# EAGLE design HoloProjector LED I2C v1.0 (EAGLE 6.4)
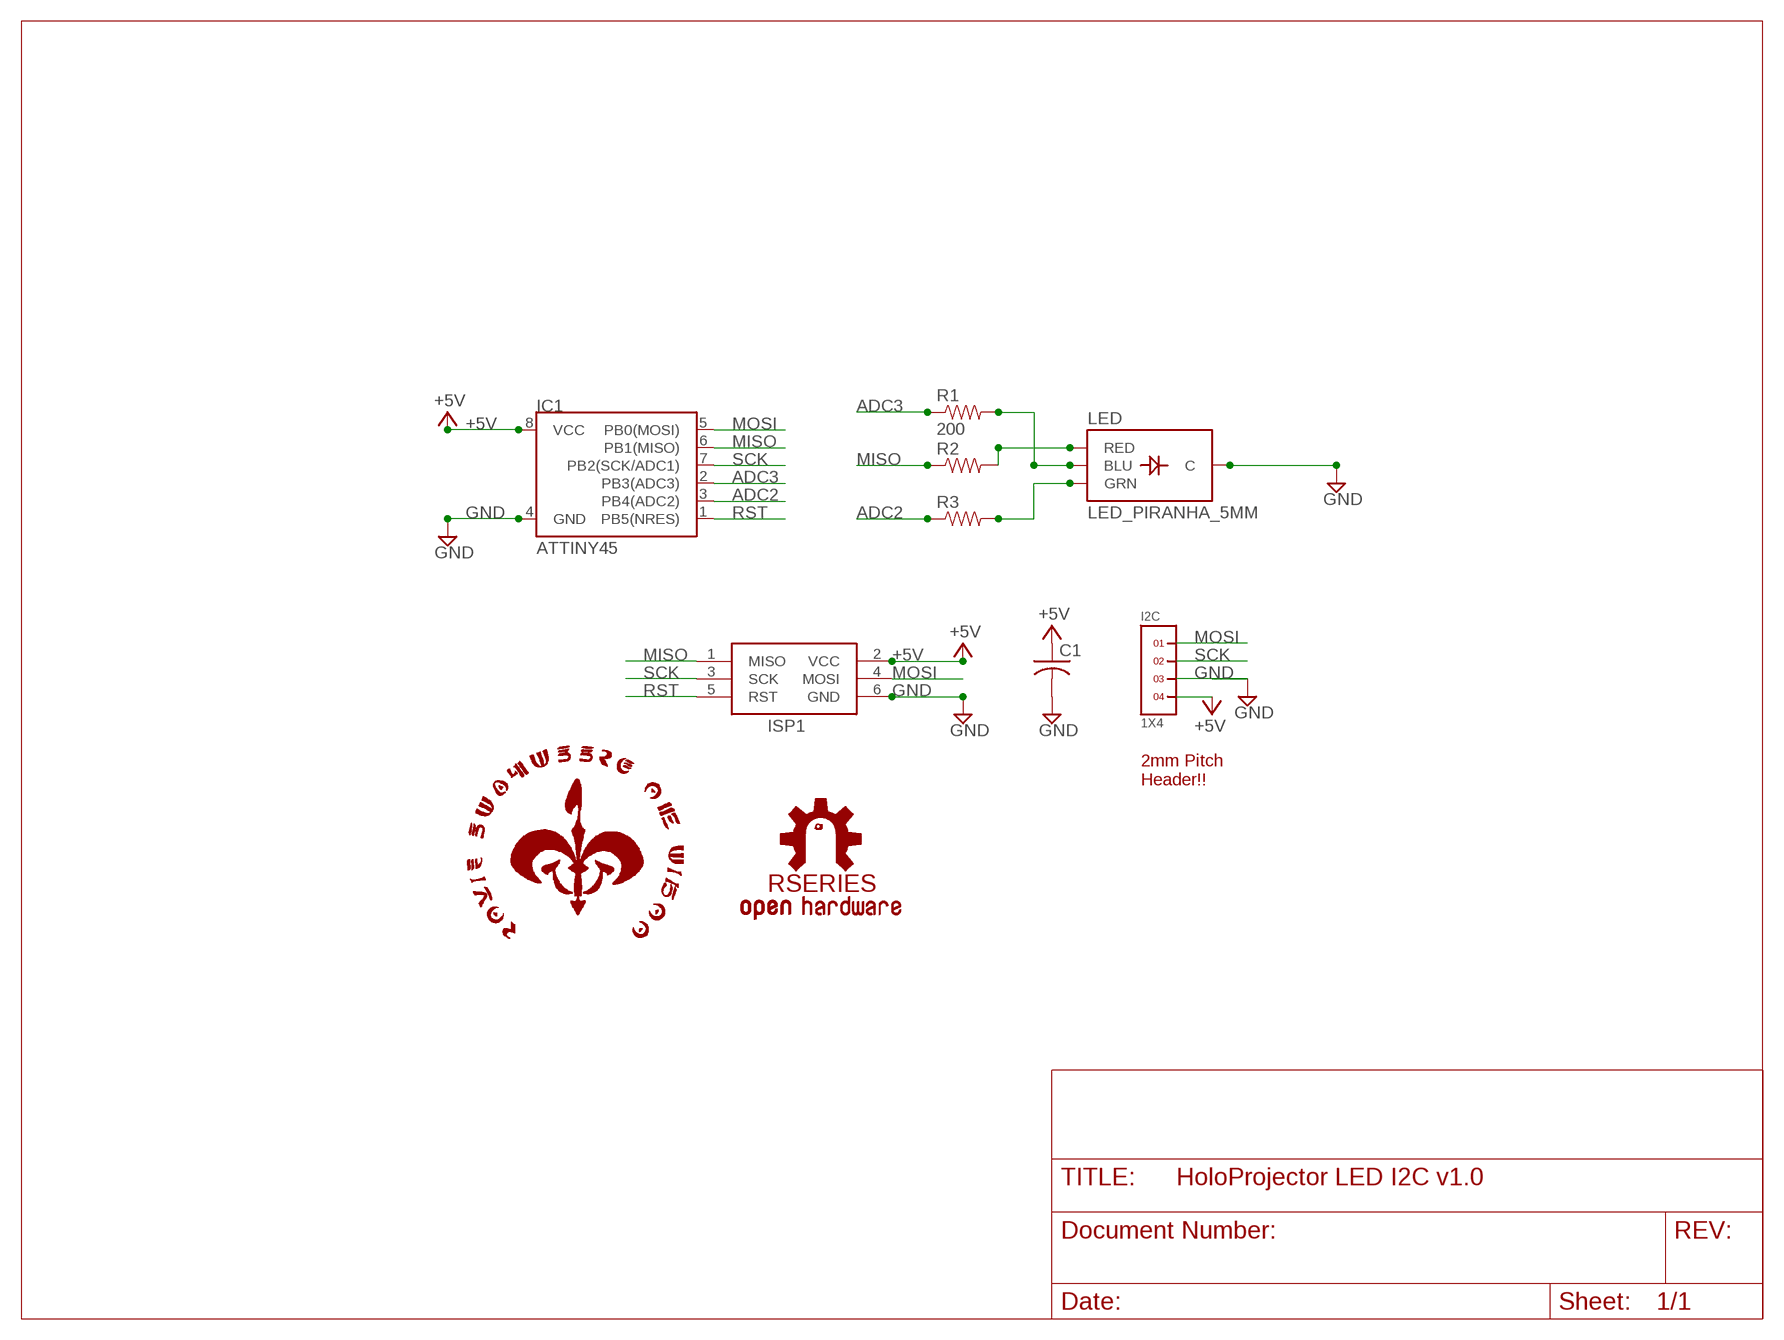
[diagram p0: schematic, sheet 1]

## Parts
C1  C-USC1206K  [C1206K]
I2C  1X4  [1X4]
IC1  ATTINY45  [SO08-EIAJ]
ISP1  AVRISP-6  [AVRISP]
LED  LED_PIRANHA_5MM  [LED_PIRANHA_5MM]
R1  200  RESISTOR1206  [1206]
R2  RESISTOR1206  [1206]
R3  RESISTOR1206  [1206]
U$1  ROYAL-ENGINEERS-OF-NABOOSMALL  [ROYAL-ENGINEERS-OF-NABOO-SMALL]
U$2  RSERIES-OSHW-LOGOMEDIUM  [RSERIES-OSHW-LOGO-MEDIUM]

## Nets
+5V [supply]: C1.1 I2C.4 IC1.8(VCC) ISP1.2(VCC)
ADC2: IC1.3(PB4(ADC2)) R3.1
ADC3: IC1.2(PB3(ADC3)) R1.1
GND [supply]: C1.2 I2C.3 IC1.4(GND) ISP1.6(GND) LED.-(C)
MISO: IC1.6(PB1(MISO)) ISP1.1(MISO) R2.1
MOSI: I2C.1 IC1.5(PB0(MOSI)) ISP1.4(MOSI)
N$1: LED.B(BLU) R1.2
N$2: LED.R(RED) R2.2
N$3: LED.G(GRN) R3.2
RST: IC1.1(PB5(NRES)) ISP1.5(RST)
SCK: I2C.2 IC1.7(PB2(SCK/ADC1)) ISP1.3(SCK)

## Notes on the sheet
- 2mm Pitch
  Header!!

## Library data of the parts
C1 = rcl:C-US: CAPACITOR, American symbol
I2C = headers(2mm):1X4
IC1 = SparkFun-DigitalIC:ATTINY45: Atmel 8-pin 2/4/8kB flash uC
ISP1 = adafruit:AVRISP: AVR ISP HEADER Standard 6 pin header for AVR programming
LED = SparkFun-LED:LED_PIRANHA_5MM: High-brightness RGB through-hole LED, similar to that used in the Shiftbrite
R1-R3 = SparkFun-Passives:RESISTOR: Resistor Basic schematic elements and footprints for 0603, 1206, and PTH resistors.
U$1 = rseries:ROYAL-ENGINEERS-OF-NABOO: Royal Engineers of Naboo Circle Logo
U$2 = rseries:RSERIES-OSHW-LOGO

## Net classes
1 supply: width 0.381 mm, clearance 0.152 mm

## Board
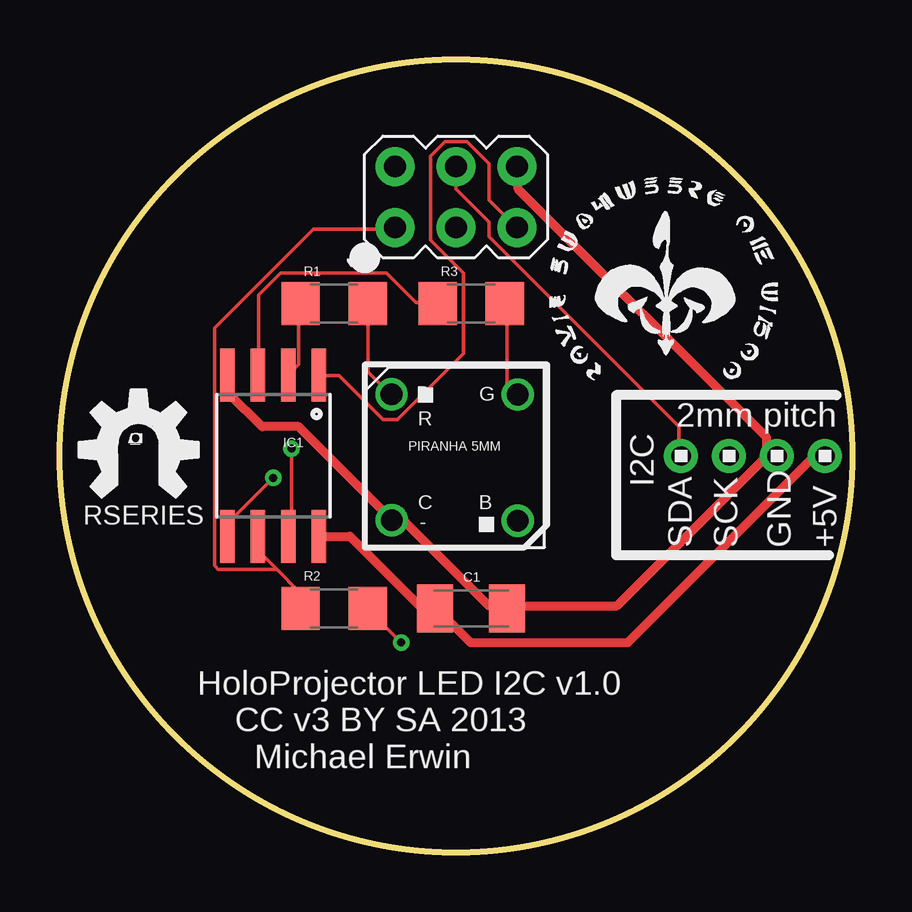
[diagram p1: board, top side]
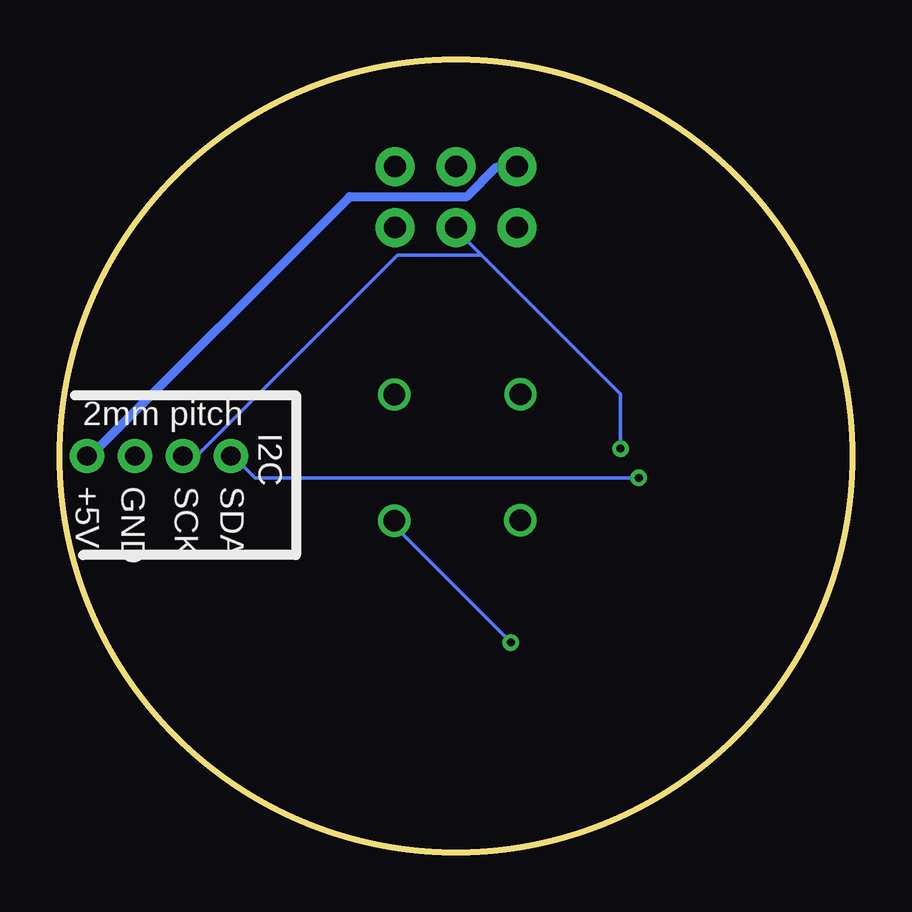
[diagram p2: board, bottom side, seen from below]

Size 33.02 x 33.02 mm. Coordinates in mm from the lower left corner, seen from the top.
Outline: circle at 16.51,16.51 radius 16.51
Copper layers (1*16): Top 0.0356mm / dielectric 1.5011mm / Bottom 0.0356mm
Design rules "LaenPCBOrder *": minimum track width 6mil, minimum drill 13mil, track to track 6mil, track to pad 6mil, pad to pad 6mil, via to via 12mil, smd to smd 6mil, copper to edge 15mil, drill to drill 6mil, minimum pad ring 7mil, minimum via ring 7mil, stop-mask expansion 4mil, vias tented up to drill 13mil, thermal gap 10mil

### Footprints (pad centres in the part's own frame; a part is rotated, then mirrored left to right if it is on the bottom)
C1206K = smd 1.5 x 2: 1 -1.5,0; 2 1.5,0
1X4 = drill 0.8 pad 1.422: 1 -3,0; 2 -1,0; 3 1,0; 4 3,0
SO08-EIAJ = smd 0.61 x 2.21: 1 -1.905,-3.378; 2 -0.635,-3.378; 3 0.635,-3.378; 4 1.905,-3.378; 5 1.905,3.353; 6 0.635,3.353; 7 -0.635,3.353; 8 -1.905,3.353
AVRISP = drill 0.9 pad 1.626: 1 -1.27,2.54; 2 1.27,2.54; 3 -1.27,0; 4 1.27,0; 5 -1.27,-2.54; 6 1.27,-2.54
LED_PIRANHA_5MM = drill 0.9: - -2.684,-2.684; B -2.688,2.574; G 2.575,2.562; R 2.579,-2.696
1206 = smd 1.6 x 1.8: 1 -1.4,0; 2 1.4,0

### Placement (x,y rotation side)
C1  17.14,10.16 0 top
I2C  28.89,16.51 0 top
IC1  8.89,16.51 180 top
ISP1  16.51,27.3 90 top
LED  16.51,16.51 0 top
R1  11.43,22.86 0 top
R2  11.43,10.16 0 top
R3  17.14,22.86 0 top
U$1  20.32,19.37 0 top
U$2  3.18,16.83 0 top

### Tracks (layer width: path | path; a pad name or v marks a point on that pad's centre or on a via)
+5V
  Top 0.381: IC1.8 10.87,13.16 12.09,13.16 14.99,10.26 15.6,10.26 C1.1 15.75,10.11 17.12,8.74 23.67,8.74 31.45,16.51 31.75,16.51 I2C.4
  Bottom 0.381: ISP1.2 14.07,28.55 14.83,28.55 16.05,27.33 20.93,27.33 31.75,16.51 I2C.4
ADC2
  Top 0.152: R3.1 15.6,22.91 14.83,22.91 13.61,24.13 9.2,24.13 8.28,23.22 8.28,20.02 IC1.3
ADC3
  Top 0.152: R1.1 9.96,22.76 9.96,20.32 9.65,20.02 IC1.2
GND
  Top 0.381: IC1.4 7.06,19.86 7.06,19.1 8.43,17.73 9.96,17.73 13.77,13.92 LED.- 13.92,13.77 14.38,13.77 17.88,10.26 18.64,10.26 C1.2 18.8,10.26 23.22,10.26 29.46,16.51 29.77,16.51 I2C.3 29.46,16.66 29.46,17.27 19.1,27.64 19.1,28.55 ISP1.6
MISO
  Top 0.152: 9.04,11.79 8.28,12.55 8.28,13.16 IC1.6 | 9.04,11.79 9.96,10.87 9.96,10.26 R2.1 | 9.04,11.79 6.6,11.79 6.45,11.94 6.45,21.84 10.57,25.96 13.92,25.96 ISP1.1
MOSI  (via drill 0.33)
  Top 0.152: v8.89,15.6 7.06,13.77 7.06,13.16 IC1.5 | ISP1.4 16.51,28.55 16.51,27.64 17.88,26.26 17.88,25.65 25.81,17.73 25.81,16.51 I2C.1
  Bottom 0.152: v8.89,15.6 24.89,15.6 25.81,16.51 I2C.1
N$1
  Top 0.152: R1.2 12.85,22.76 12.85,20.02 13.77,19.1 LED.B
N$2  (via drill 0.33)
  Top 0.152: v14.22,8.74 12.85,10.11 R2.2
  Bottom 0.152: v14.22,8.74 18.95,13.46 18.95,13.77 LED.R
N$3
  Top 0.152: R3.2 18.64,22.76 18.64,19.41 18.95,19.1 LED.G
RST
  Top 0.152: IC1.1 10.87,19.86 11.63,19.86 13.46,18.03 14.07,18.03 16.82,20.78 16.82,24.13 15.44,25.5 15.44,29.01 16.05,29.62 16.97,29.62 17.88,28.7 17.88,27.18 18.95,26.11 ISP1.5
SCK  (via drill 0.33)
  Top 0.152: v9.65,16.82 9.65,13.16 IC1.7
  Bottom 0.152: v9.65,16.82 9.65,19.1 15.44,24.89 | 15.44,24.89 16.51,25.96 ISP1.3 | 15.44,24.89 18.95,24.89 27.33,16.51 27.79,16.51 I2C.2

### Text on the board
tPlace: R | C | B
_tsilk: 2mm pitch | I2C | RSERIES | SDA | SCK | GND | +5V | HoloProjector LED I2C v1.0 / CC v3 BY SA 2013 / Michael Erwin
_bsilk: I2C | 2mm pitch | SDA | SCK | GND | +5V